# EAGLE design Wireless Coordinator v2.2 (EAGLE 6.3)
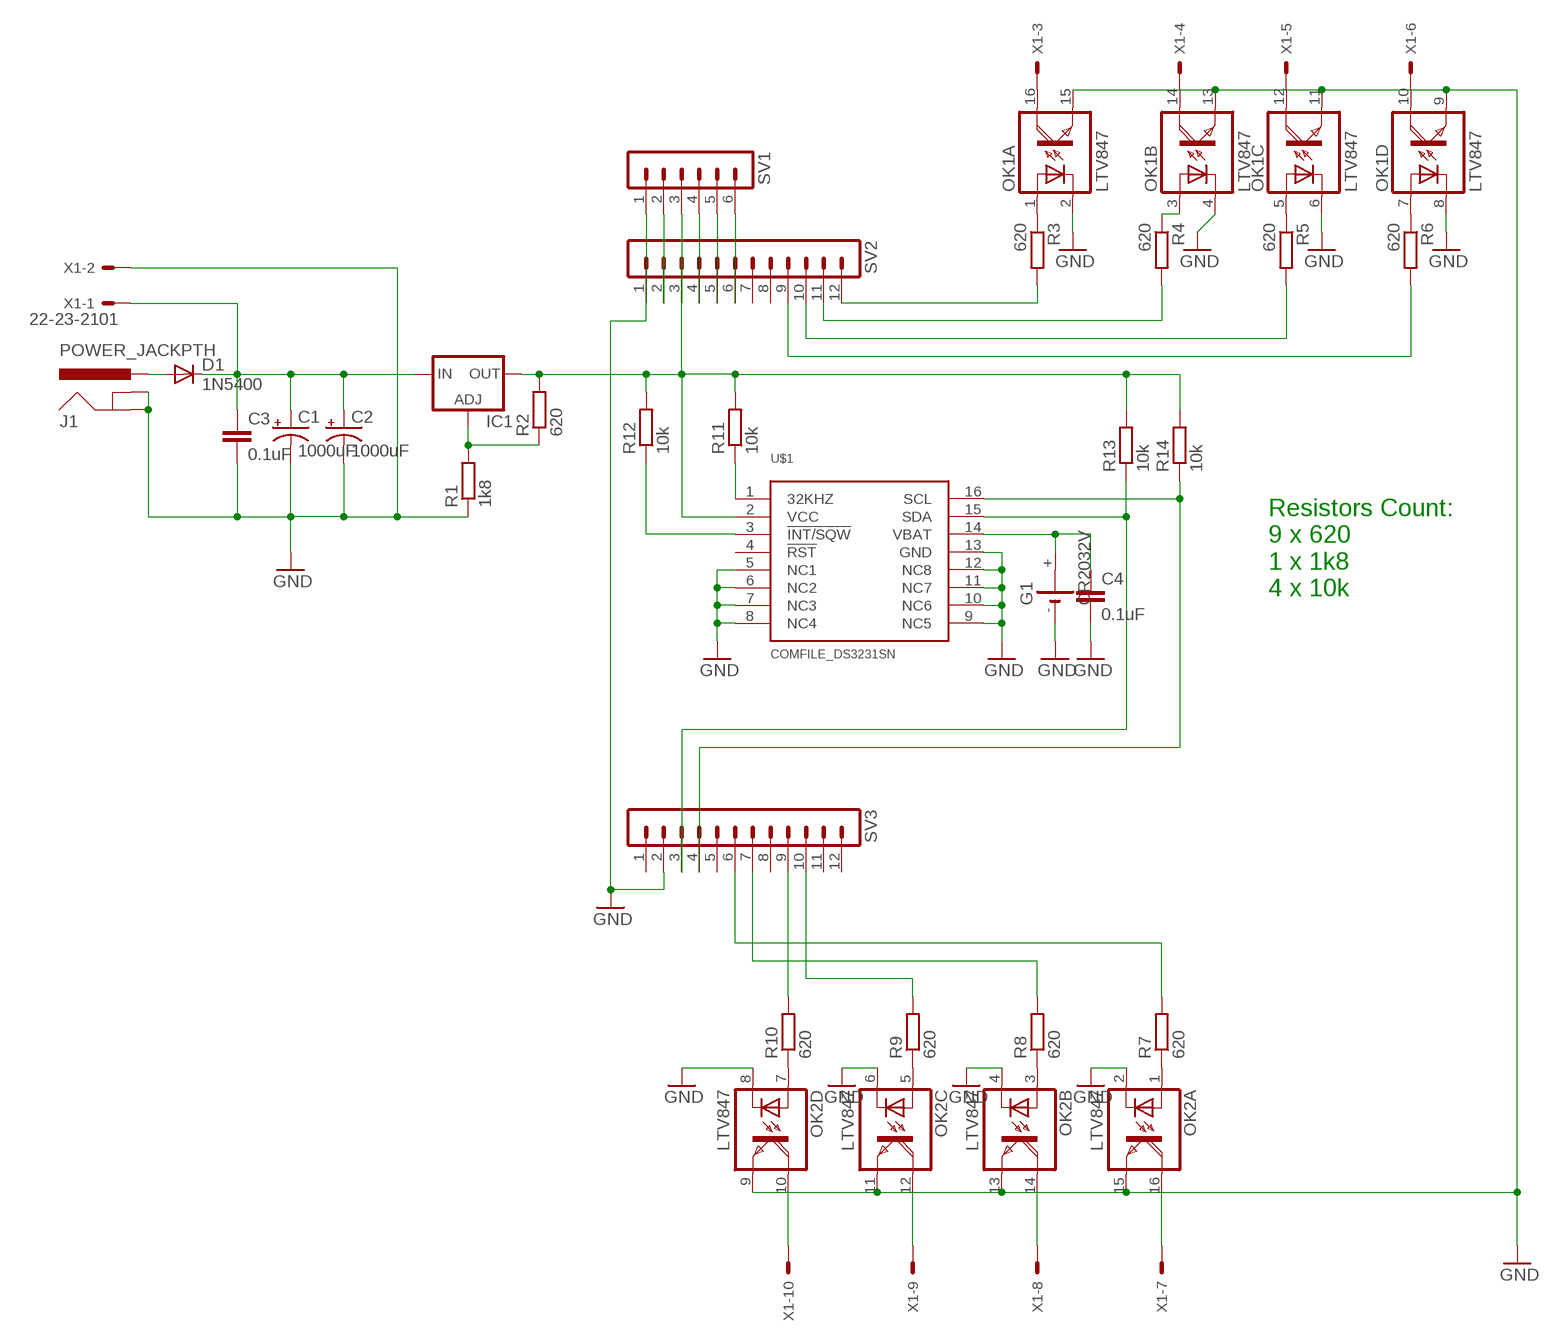
[diagram p0: schematic, sheet 1]

## Parts
C1  1000uF  CPOL-USE5-10.5  [E5-10,5]
C2  1000uF  CPOL-USE3.5-8  [E3,5-8]
C3  0.1uF  C-EU050-025X075  [C050-025X075]
C4  0.1uF  C-EU050-025X075  [C050-025X075]
D1  1N5400  [DO201-15]
G1  CR2032V  [CR2032V]
IC1  LM317TS  [317TS]
J1  POWER_JACKPTH  [POWER_JACK_PTH]
OK1  LTV847  [DIL16]
OK2  LTV847  [DIL16]
R1  1k8  R-EU_0207/12  [0207/12]
R2  620  R-EU_0207/12  [0207/12]
R3  620  R-EU_0207/12  [0207/12]
R4  620  R-EU_0207/12  [0207/12]
R5  620  R-EU_0207/12  [0207/12]
R6  620  R-EU_0207/12  [0207/12]
R7  620  R-EU_0207/12  [0207/12]
R8  620  R-EU_0207/12  [0207/12]
R9  620  R-EU_0207/12  [0207/12]
R10  620  R-EU_0207/12  [0207/12]
R11  10k  R-EU_0207/12  [0207/12]
R12  10k  R-EU_0207/12  [0207/12]
R13  10k  R-EU_0207/12  [0207/12]
R14  10k  R-EU_0207/12  [0207/12]
SV1  MA06-1  [MA06-1]
SV2  MA12-1  [MA12-1]
SV3  MA12-1  [MA12-1]
U$1  COMFILE_DS3231SN  [COMFILE_SO16W]
X1  22-23-2101  [22-23-2101]

## Nets
GND: C1.- C2.- C3.2 C4.2 G1.- J1.GND J1.GNDBREAK OK1.2(A:C) OK1.4(B:C) OK1.6(C:C) OK1.8(D:C) OK1.9(D:EMI) OK1.11(C:EMI) OK1.13(B:EMI) OK1.15(A:EMI) OK2.2(A:C) OK2.4(B:C) OK2.6(C:C) OK2.8(D:C) OK2.9(D:EMI) OK2.11(C:EMI) OK2.13(B:EMI) OK2.15(A:EMI) R1.1 SV1.1 SV2.1 SV3.2 U$1.5(NC1) U$1.6(NC2) U$1.7(NC3) U$1.8(NC4) U$1.9(NC5) U$1.10(NC6) U$1.11(NC7) U$1.12(NC8) U$1.13(GND) X1.2
N$1: IC1.1(ADJ) R1.2 R2.1
N$2: SV1.2 SV2.2
N$3: IC1.2(OUT) R2.2 R11.2 R12.2 R13.2 R14.2 SV1.3 SV2.3 U$1.2(VCC)
N$4: SV1.4 SV2.4
N$5: D1.A J1.PWR
N$6: SV1.5 SV2.5
N$7: SV1.6 SV2.6
N$8: C1.+ C2.+ C3.1 D1.C IC1.3(IN) X1.1
N$9: OK1.1(A:A) R3.1
N$10: OK1.3(B:A) R4.1
N$11: OK1.5(C:A) R5.1
N$12: OK1.7(D:A) R6.1
N$13: OK1.16(A:COL) X1.3
N$14: R4.2 SV2.11
N$15: OK1.14(B:COL) X1.4
N$16: R6.2 SV2.9
N$17: OK1.12(C:COL) X1.5
N$18: R5.2 SV2.10
N$19: OK1.10(D:COL) X1.6
N$20: OK2.1(A:A) R7.1
N$21: R3.2 SV2.12
N$22: OK2.3(B:A) R8.1
N$23: OK2.5(C:A) R9.1
N$24: OK2.7(D:A) R10.1
N$25: OK2.16(A:COL) X1.7
N$26: OK2.14(B:COL) X1.8
N$27: OK2.12(C:COL) X1.9
N$28: OK2.10(D:COL) X1.10
N$29: R10.2 SV3.9
N$30: R9.2 SV3.10
N$31: R8.2 SV3.7
N$32: R7.2 SV3.6
N$33: R11.1 U$1.1(32KHZ)
N$34: C4.1 G1.+ U$1.14(VBAT)
N$35: R12.1 U$1.3(!INT/SQW)
N$36: R13.1 SV3.3 U$1.15(SDA)
N$37: R14.1 SV3.4 U$1.16(SCL)
Unconnected: G1.+@1(+) SV2.7 SV2.8 SV3.1 SV3.5 SV3.8 SV3.11 SV3.12 U$1.4(!RST)

## Notes on the sheet
- Resistors Count:
  9 x 620
  1 x 1k8
  4 x 10k

## Library data of the parts
C1 C2 = rcl:CPOL-US: POLARIZED CAPACITOR, American symbol
C3 C4 = rcl:C-EU: CAPACITOR, European symbol
D1 = diode:1N5400: DIODE standard rectifier, 3 A, 50 V (Motorola)
G1 = battery:CR2032V: LI BATTERY Varta
IC1 = v-reg:LM317TS: VOLTAGE REGULATOR
J1 = SparkFun-Connectors:POWER_JACK: Power Jack This is the standard 5.5mm barrel jack for power. The PTH is the most common, proven, reliable, footprint. The Slot footprint only works if the mill layer is transmitted to the PCB fab house so be warned. Spark Fun Electronics SKU : PRT-00119 SMT: CONN-08106 Mating wall wart : TOL-00298 (and others)
OK1 OK2 = optocoupler_vg:LTV847: LITEON OPTO COUPLER; MF: LITEON; MPN: LTV847
R1-R14 = rcl:R-EU_: RESISTOR, European symbol
SV1 = con-lstb:MA06-1: PIN HEADER; OC_FARNELL: unknown; OC_NEWARK: unknown
SV2 SV3 = con-lstb:MA12-1: PIN HEADER; OC_FARNELL: unknown; OC_NEWARK: unknown
U$1 = DS3231:COMFILE_DS3231SN
X1 = con-molex:22-23-2101: .100" (2.54mm) Center Header - 10 Pin; MF: MOLEX; MPN: 22-23-2101; OC_FARNELL: 1756828; OC_NEWARK: 94C0765

## Board
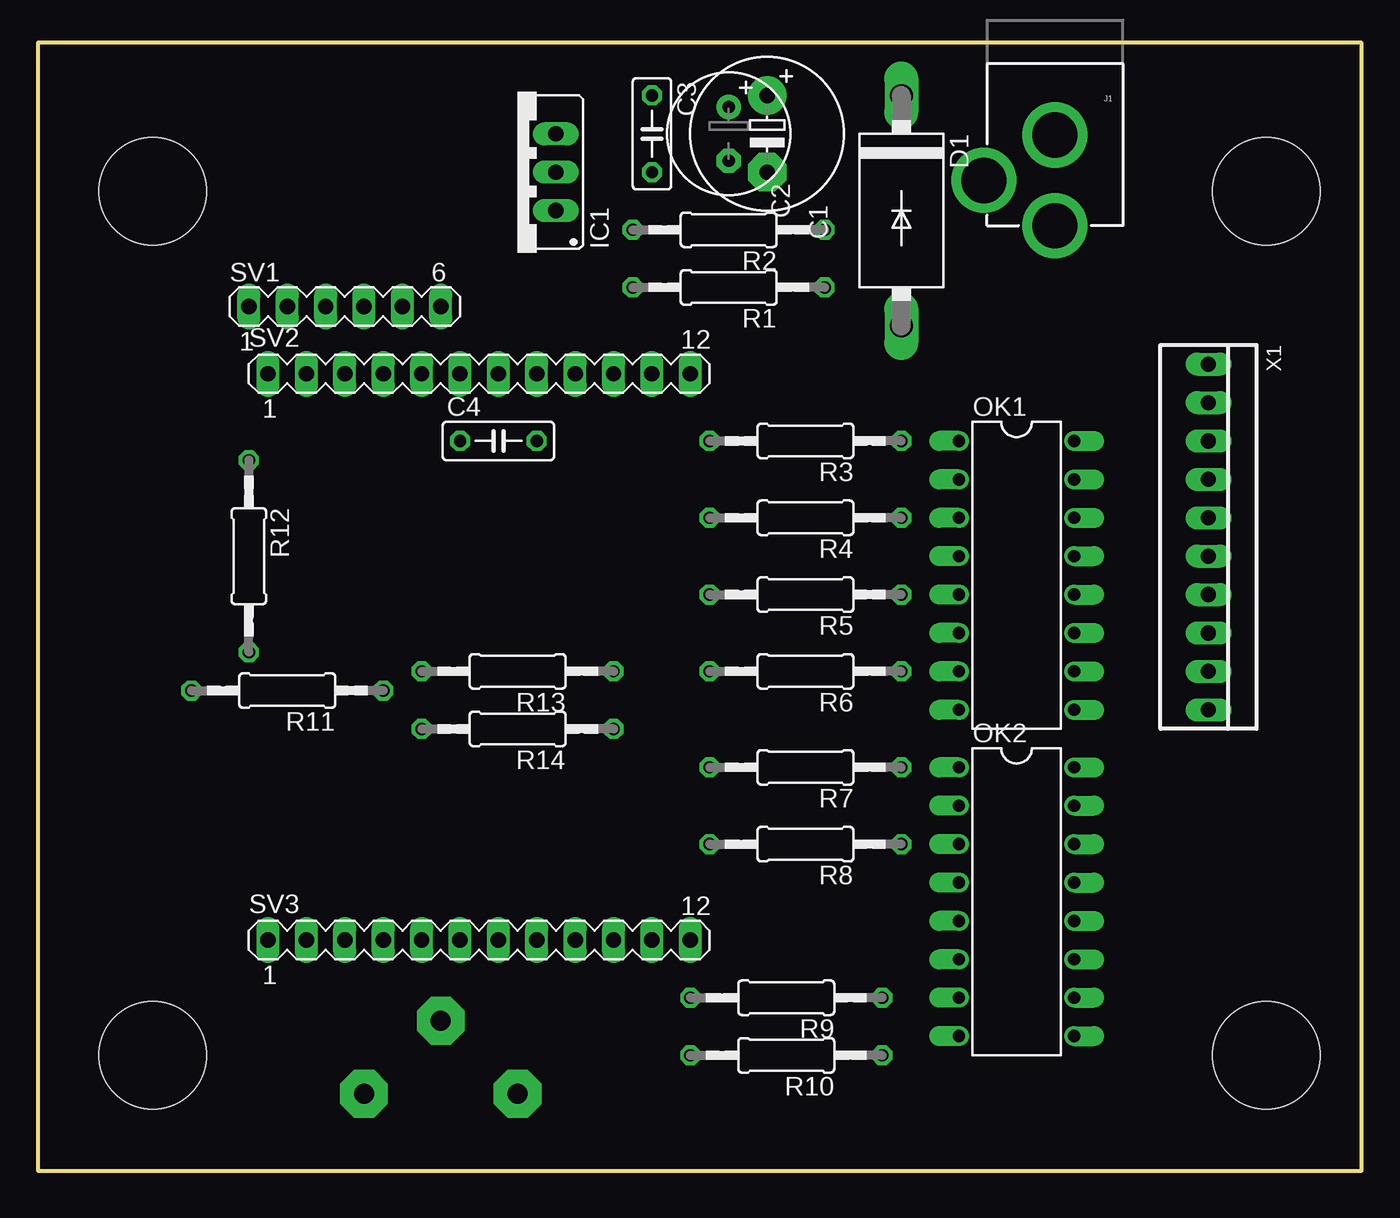
[diagram p1: board, top side]
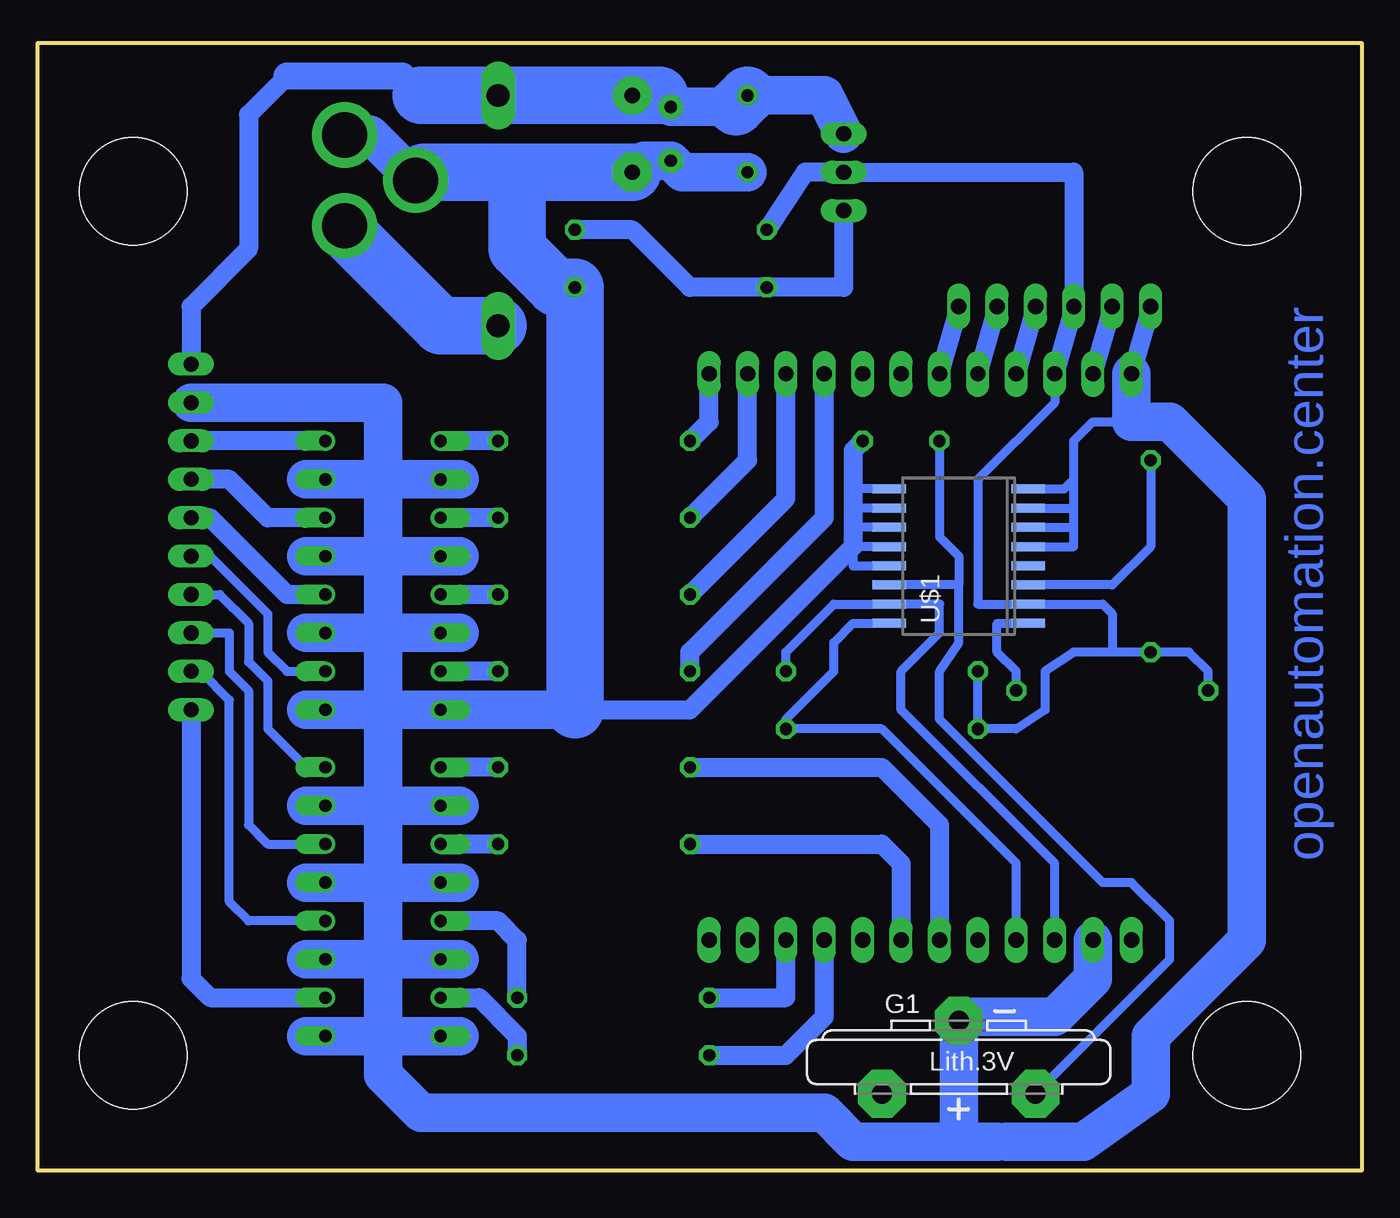
[diagram p2: board, bottom side, seen from below]

Size 87.61 x 74.6 mm. Coordinates in mm from the lower left corner, seen from the top.
Outline: 0,0 87.61,0 87.61,74.6 0,74.6 0,0
Copper layers (1*16): Top 0.035mm / dielectric 1.5mm / Bottom 0.035mm
Design rules "default *": minimum track width 16mil, minimum drill 24mil, track to track 20mil, track to pad 10mil, pad to pad 10mil, via to via 12mil, smd to smd 10mil, copper to edge 40mil, drill to drill 8mil, minimum pad ring 10mil, minimum via ring 8mil, stop-mask expansion 4mil, vias tented up to drill 0mil, thermal gap 20mil
Holes 7.11 mm at 7.62,7.62 81.28,64.77 81.28,7.62 7.62,64.77

### Footprints (pad centres in the part's own frame; a part is rotated, then mirrored left to right if it is on the bottom)
E5-10,5 = drill 1.016 pad 2.54: + -2.54,0 | drill 1.016 pad 2.54 octagon: - 2.54,0
E3,5-8 = drill 0.813 pad 1.6: + -1.778,0 | drill 0.813 pad 1.6 octagon: - 1.778,0
C050-025X075 = drill 0.813 octagon: 1 -2.54,0; 2 2.54,0
DO201-15 = drill 1.499 long: A 7.62,0; C -7.62,0
CR2032V = drill 1.321 pad 3.15 octagon: + -2.54,-5.08; +@1 -2.54,5.08; - 2.286,0
317TS = drill 1.016 long: 1 -2.54,-2.54; 2 0,-2.54; 3 2.54,-2.54
POWER_JACK_PTH = drill 2.997 pad 4.318: GND 0,7.7; GNDBREAK 4.7,10.7; PWR 0,13.7
DIL16 = drill 0.813 offset: 1 -8.89,-3.81; 2 -6.35,-3.81; 3 -3.81,-3.81; 4 -1.27,-3.81; 5 1.27,-3.81; 6 3.81,-3.81; 7 6.35,-3.81; 8 8.89,-3.81; 9 8.89,3.81; 10 6.35,3.81; 11 3.81,3.81; 12 1.27,3.81; 13 -1.27,3.81; 14 -3.81,3.81; 15 -6.35,3.81; 16 -8.89,3.81
0207/12 = drill 0.813 octagon: 1 -6.35,0; 2 6.35,0
MA06-1 = drill 1.016 long: 1 -6.35,0; 2 -3.81,0; 3 -1.27,0; 4 1.27,0; 5 3.81,0; 6 6.35,0
MA12-1 = drill 1.016 long: 1 -13.97,0; 2 -11.43,0; 3 -8.89,0; 4 -6.35,0; 5 -3.81,0; 6 -1.27,0; 7 1.27,0; 8 3.81,0; 9 6.35,0; 10 8.89,0; 11 11.43,0; 12 13.97,0
COMFILE_SO16W = smd 0.6 x 2.2: 1 -4.445,-4.6; 2 -3.175,-4.6; 3 -1.905,-4.6; 4 -0.635,-4.6; 5 0.635,-4.6; 6 1.905,-4.6; 7 3.175,-4.6; 8 4.445,-4.6; 9 4.445,4.6; 10 3.175,4.6; 11 1.905,4.6; 12 0.635,4.6; 13 -0.635,4.6; 14 -1.905,4.6; 15 -3.175,4.6; 16 -4.445,4.6
22-23-2101 = drill 1 long: 1 -11.43,0; 2 -8.89,0; 3 -6.35,0; 4 -3.81,0; 5 -1.27,0; 6 1.27,0; 7 3.81,0; 8 6.35,0; 9 8.89,0; 10 11.43,0

### Placement (x,y rotation side)
C1  48.26,68.58 270 top
C2  45.72,68.58 270 top
C3  40.64,68.58 270 top
C4  30.48,48.26 0 top
D1  57.15,63.5 270 top
G1  26.67,7.62 90 bottom
IC1  31.75,66.04 90 top
J1  67.31,76.2 180 top
OK1  64.77,39.37 270 top
OK2  64.77,17.78 270 top
R1  45.72,58.42 180 top
R2  45.72,62.23 180 top
R3  50.8,48.26 180 top
R4  50.8,43.18 180 top
R5  50.8,38.1 180 top
R6  50.8,33.02 180 top
R7  50.8,26.67 180 top
R8  50.8,21.59 180 top
R9  49.53,11.43 180 top
R10  49.53,7.62 180 top
R11  16.51,31.75 180 top
R12  13.97,40.64 270 top
R13  31.75,33.02 180 top
R14  31.75,29.21 180 top
SV1  20.32,57.15 0 top
SV2  29.21,52.71 0 top
SV3  29.21,15.24 0 top
U$1  26.67,40.64 90 bottom
X1  77.47,41.91 270 top

### Tracks (layer width: path | path; a pad name or v marks a point on that pad's centre or on a via)
GND
  Bottom 0.61: 33.66,41.28 33.66,42.55 | U$1.12 33.66,41.28 | 33.66,41.28 33.66,40.01 U$1.13 | U$1.11 33.66,42.55 | U$1.10 33.66,43.82 | 33.66,43.82 33.66,45.09 U$1.9 | 33.66,42.55 33.66,43.82 | U$1.8 19.68,45.09 19.05,45.72 | 19.05,45.72 19.05,48.26 17.78,49.53 15.24,49.53 | U$1.7 19.05,43.82 | 19.05,43.82 19.05,45.72 | U$1.6 19.05,42.55 | 19.05,42.55 19.05,43.82 | U$1.5 19.05,41.28 19.05,42.55
  Bottom 1.27: 52.07,53.34 53.34,52.07 | 59.69,30.48 OK1.8 | SV1.1 SV2.1 | G1.- 26.42,10.16 26.67,10.16 | 23.5,1.91 23.81,2.22 24.13,1.91 | 64.77,30.48 52.07,30.48 44.45,30.48 33.66,41.28 33.66,45.09 33.66,47.63 C4.2 | 64.77,45.72 64.77,46.99
  Bottom 2.54: C3.2 44.96,66.04 C2.- 47.5,66.8 C1.- | J1.GND 65.61,68.5 J1.GNDBREAK | 52.07,30.48 OK1.8 64.77,30.48 | 64.77,45.72 OK1.15 69.85,45.72 | 59.69,45.72 OK1.2 64.77,45.72 | 64.77,45.72 64.77,40.64 | 59.69,40.64 OK1.4 64.77,40.64 | 64.77,40.64 64.77,35.56 | 64.77,35.56 OK1.11 69.85,35.56 | 69.85,30.48 OK1.9 64.77,30.48 | 64.77,30.48 64.77,35.56 | 64.77,35.56 OK1.6 59.69,35.56 | 64.77,30.48 64.77,24.13 | 59.69,24.13 OK2.2 64.77,24.13 | 64.77,24.13 OK2.15 69.85,24.13 | 64.77,24.13 64.77,19.05 | 59.69,19.05 OK2.4 64.77,19.05 | 69.85,19.05 OK2.13 64.77,19.05 | 64.77,19.05 64.77,13.97 | 59.69,13.97 OK2.6 64.77,13.97 | 69.85,13.97 OK2.11 64.77,13.97 | 64.77,13.97 64.77,8.89 | 64.77,8.89 OK2.9 | 69.85,8.89 OK2.9 | OK2.9 OK2.8 59.69,8.89 | X1.2 64.77,50.8 64.77,46.99 | 64.77,40.64 OK1.13 69.85,40.64 | 26.42,10.16 20.32,10.16 17.78,12.7 SV3.2 | 26.67,10.16 26.67,1.91 | 23.5,1.91 18.41,1.91 13.97,5.08 13.97,8.89 7.62,15.24 7.62,44.45 12.7,49.53 15.24,49.53 SV2.1 | 64.77,8.89 64.77,6.35 62.23,3.81 35.56,3.81 33.66,1.91 26.67,1.91 | 26.67,1.91 24.13,1.91
  Bottom 3.81: 52.07,30.48 52.07,53.34 R1.1 53.34,58.42 55.88,60.96 55.88,66.04 | C1.- 55.88,66.04 | 55.88,66.04 62.07,66.04 J1.GNDBREAK
N$1
  Bottom 1.27: IC1.1 34.29,58.42 R1.2 44.45,58.42 48.26,62.23 R2.1
N$2
  Bottom 1.27: SV1.2 SV2.2
N$3
  Bottom 0.61: R13.2 R14.2 22.86,29.21 20.95,30.48 20.95,33.02 19.05,34.29 16.51,34.29 | 16.51,34.29 R12.2 11.43,34.29 10.16,33.02 R11.2 | SV2.3 20.32,50.8 25.4,45.72 25.4,37.47 U$1.2 17.14,37.47 16.51,36.83 16.51,34.29
  Bottom 1.27: R2.2 36.83,66.04 IC1.2 19.05,66.04 SV1.3 SV2.3
N$4
  Bottom 1.27: SV1.4 SV2.4
N$5
  Bottom 3.81: J1.PWR 67.31,62.23 60.96,55.88 D1.A
N$6
  Bottom 1.27: SV1.5 SV2.5
N$7
  Bottom 1.27: SV1.6 SV2.6
N$8
  Bottom 1.27: 62.23,71.12 63.5,72.39 | 71.12,72.39 73.66,69.85 73.66,60.96 77.47,57.15 X1.1
  Bottom 1.778: 63.5,72.39 71.12,72.39
  Bottom 2.54: 46.48,71.12 C2.+ 41.4,70.36 | C3.1 35.56,71.12 IC1.3
  Bottom 3.81: 46.48,71.12 C1.+ D1.C 62.23,71.12 | 41.4,70.36 C3.1
N$9
  Bottom 1.27: R3.1 OK1.1
N$10
  Bottom 1.27: R4.1 OK1.3
N$11
  Bottom 1.27: R5.1 OK1.5
N$12
  Bottom 1.27: R6.1 OK1.7
N$13
  Bottom 1.27: OK1.16 X1.3
N$14
  Bottom 1.27: R4.2 40.64,46.99 SV2.11
N$15
  Bottom 1.27: OK1.14 72.39,43.18 74.93,45.72 X1.4
N$16
  Bottom 1.27: R6.2 44.45,34.29 35.56,43.18 SV2.9
N$17
  Bottom 1.27: OK1.12 71.12,38.1 76.2,43.18 X1.5
N$18
  Bottom 1.27: R5.2 38.1,44.45 SV2.10
N$19
  Bottom 0.61: X1.6 76.2,40.64 72.39,36.83 72.39,34.29 71.12,33.02 OK1.10
N$20
  Bottom 1.27: R7.1 OK2.1
N$21
  Bottom 1.27: R3.2 43.18,49.53 SV2.12
N$22
  Bottom 1.27: R8.1 OK2.3
N$23
  Bottom 1.27: R9.1 55.88,15.24 57.15,16.51 OK2.5
N$24
  Bottom 1.27: OK2.7 58.42,11.43 55.88,8.89 R10.1
N$25
  Bottom 0.61: X1.7 75.56,38.1 73.66,36.2 73.66,33.66 72.39,32.39 72.39,29.21 69.85,26.67 OK2.16
N$26
  Bottom 0.61: X1.8 74.93,35.56 74.93,33.02 73.66,31.75 73.66,22.86 72.39,21.59 OK2.14
N$27
  Bottom 0.61: OK2.12 73.66,16.51 74.93,17.78 74.93,31.12 76.83,33.02 X1.9
N$28
  Bottom 1.27: X1.10 77.47,12.7 76.2,11.43 OK2.10
N$29
  Bottom 1.27: R10.2 38.1,7.62 35.56,10.16 SV3.9
N$30
  Bottom 1.27: R9.2 38.1,11.43 SV3.10
N$31
  Bottom 1.27: R8.2 31.75,21.59 30.48,20.32 SV3.7
N$32
  Bottom 1.27: R7.2 31.75,26.67 27.94,22.86 SV3.6
N$33
  Bottom 0.61: R11.1 22.86,33.02 24.13,34.29 24.13,36.2 U$1.1
N$34
  Bottom 0.61: G1.+ 12.7,13.97 12.7,16.51 15.24,19.05 17.14,19.05 27.94,29.85 27.94,33.02 26.67,34.93 26.67,38.74 | 26.67,38.74 U$1.14 | C4.1 27.94,41.91 26.67,40.64 26.67,38.74
N$35
  Bottom 0.61: R12.1 13.97,41.28 16.51,38.74 U$1.3
N$36
  Bottom 0.61: R13.1 38.1,34.29 34.92,37.47 U$1.15 27.94,37.47 27.94,35.56 30.48,33.02 30.48,30.48 20.32,20.32 SV3.3
N$37
  Bottom 0.61: U$1.16 33.66,36.2 34.92,34.93 34.92,33.02 38.1,29.85 R14.1 31.75,29.21 22.86,20.32 SV3.4

### Text on the board
Bottom: openautomation.center